# Altium schematic sheet Regulator.SchDoc: Regulation
size A; SheetNumber: 1; SheetTotal: 2
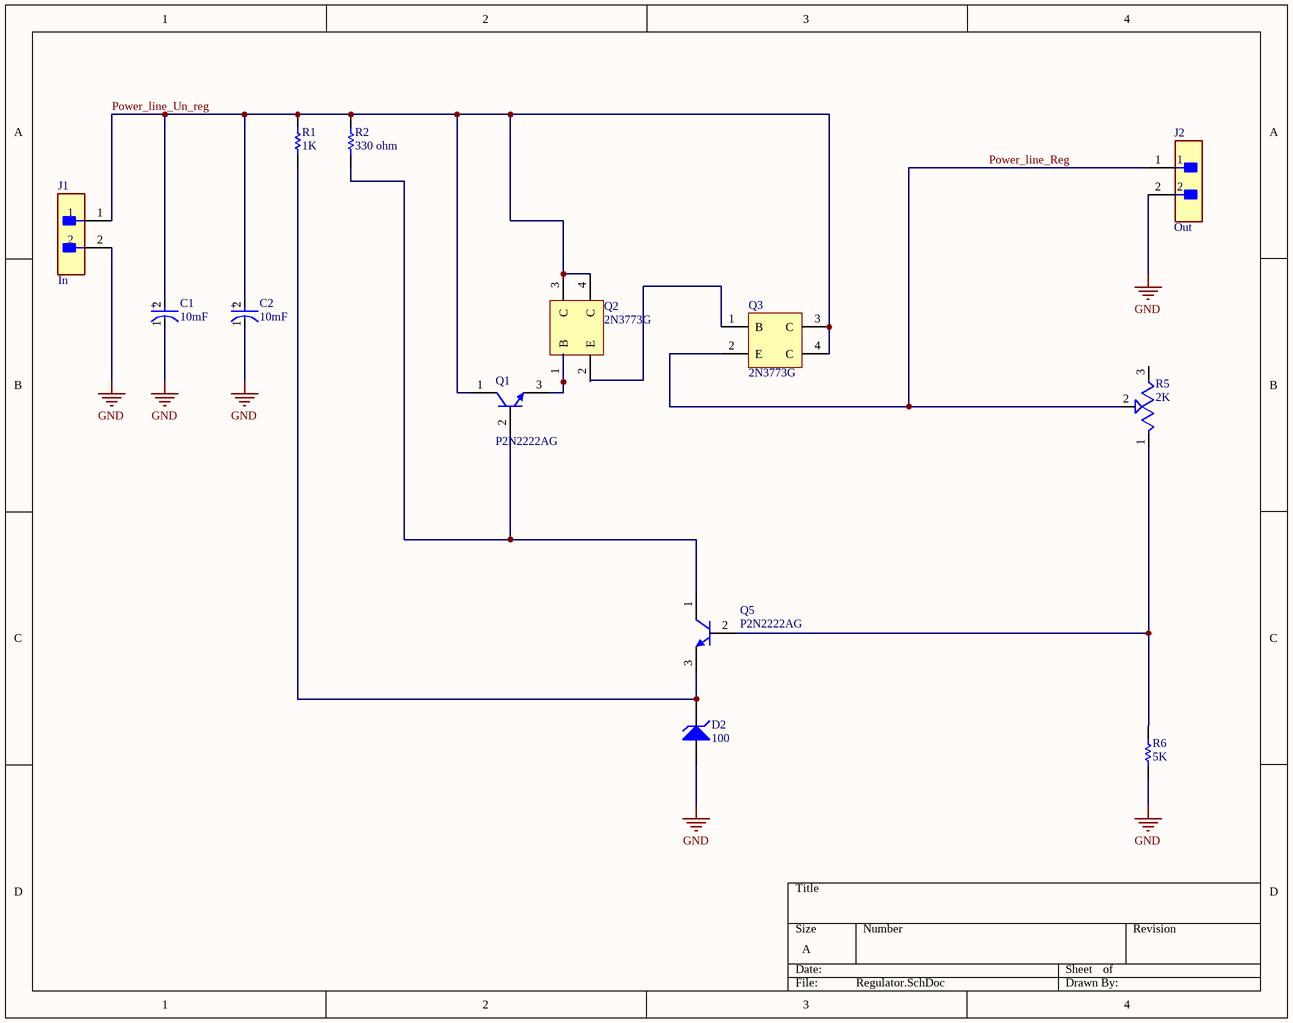
[diagram p0: Regulator.SchDoc]

## Parts
C1  10mF  [FP-RAD-TH-D_16_0_5-L_25_2-MFG]
C2  10mF  [FP-RAD-TH-D_16_0_5-L_25_2-MFG]
D2  BV: 100  (hidden comment: Zener Diode)
J1  In  [FP-B2B-XH-A_LF_SN-MFG]
J2  Out  [FP-B2B-XH-A_LF_SN-MFG]
Q1  P2N2222AG  [ONSC-TO-92-3-29-11]
Q2  2N3773G  [ONSC-TO-204-3-1-07]
Q3  2N3773G  [ONSC-TO-204-3-1-07]
Q5  P2N2222AG  [ONSC-TO-92-3-29-11]
R1  1K  [OMTE-WLA-2_V2]
R2  330 ohm  [OMTE-WLA-2_V2]
R5  2K  [TRIM_3306F-1-104]
R6  5K  [OMTE-WLA-2_V2]

## Nets
GND: C1.1(C) C2.1(C) D2.1(A) J1.2 J2.2 R6.1
Power_line_Reg: J2.1 Q3.2(E) R5.2(W)
Power_line_Un_reg: C1.2(A) C2.2(A) J1.1 Q1.1(C) Q2.3(C) Q2.4(C) Q3.3(C) Q3.4(C) R1.2 R2.2
NetD2_2: D2.2(K) Q5.3(E) R1.1
NetQ1_2: Q1.2(B) Q5.1(C) R2.1
NetQ1_3: Q1.3(E) Q2.1(B)
NetQ2_2: Q2.2(E) Q3.1(B)
NetQ5_2: Q5.2(B) R5.1(CCW) R6.2

Not connected (* = marked no-connect by the designer): R5 3(CW)

## Notes on the sheet
- (in symbol CMP-05427-001523-1) +

## Library data of the parts
C1 C2 = CMP-05427-001523-1: Aluminum Electrolytic Capacitors (Radial Lead Type) AEC-Q200 Qualified 10000uF ±20% 10V; Lead Diameter: 0.8mm; Life (Hours): 2000Hour; Lead/Base Style: Straight; Ripple Current: 1.89A; Voltage Rating: 10V; Series: HD; Case/Package: Radial; Max Operating Temperature: 105°C; Tolerance: 20%; Construction: RADIAL; REACH SVHC: No SVHC; Lead Pitch: 7.5mm; Voltage Rating (DC): 10V; RoHS Compliant: Yes; Packaging: Bulk; Voltage: 10V; Height: 25mm; Termination: Radial; Ripple Current (AC): 1.89A; Min Operating Temperature: -55°C; Diameter: 16mm; Height - Seated (Max): 1.063inch; Capacitance: 10mF; Length: 25mm; Package Quantity: 100; Mount: Through Hole
D2 = Zener Diode: AF: 1; BV_MAX: 1e99; CJO: 0; EG: 1.11; FC: 0.5; IBV: 0.001; IS: 1e-14; MJSW: 0.33; NTUN: 30; TNOM: 27; XTI: 3; SimulationGenericComponent: True; CJP: 0; CTA: 0; CTP: 0; FCS: 0.5; FV_MAX: 1e99; IKF: 0; IKR: 0; ISR: 1e-14; JSW: 0; JTUN: 0; JTUNSW: 0; KEG: 1; KF: 0; LEVEL: 1; N: 1; NBV: 1; NR: 1; NS: 1; PHP: 1; RS: 0; TCV: 0; TLEV: 0; TLEVC: 0; TM1: 0; TM2: 0; TPB: 0; TPHP: 0; TRS: 0; TRS2: 0; TT: 0; TTT1: 0; TTT2: 0; VJ: 1; XTITUN: 3
J1 J2 = CMP-2000-05888-3: CONN HEADER VERT 2POS 2.5MM; Current Rating: 3A; Voltage Rating: 250V; Number of Contacts: 2; Contact Resistance: 20mR; Wire/Cable Gauge: 22AWG; Insulation Resistance: 1GR; Connector Type: Male Pin; Packaging: Bulk; Contact Material: Brass; Lead Free: Lead Free; Orientation: Straight; Contact Plating: Tin; Max Current Rating: 3A; Termination: Solder; Fastening Type: Detent; Depth: 5.75mm; Housing Material: Polyamide; REACH SVHC: No SVHC; Series: XH; Voltage Rating (AC): 250V; Number of Positions: 2; Color: Natural; Contact Type: Male Pin; Max Voltage Rating (DC): 250V; Pitch: 2.5mm; Lead Pitch: 2.5mm; Mount: Through Hole; Max Operating Temperature: 85°C; Length: 7.4mm; Max Voltage Rating (AC): 250V; Min Operating Temperature: -25°C; Number of Rows: 1; Housing Color: White
Q1 Q5 = CMP-1048-01402-1: Amplifier Transistor, NPN Silicon, 3-Pin TO-92, Pb-Free, Bulk Box; Manufacturer: On Semiconductor; IC Continuous (A): 0.6; fT Min (MHz): 300; ComponentLink2Description: Datasheet; ComponentLink1Description: Manufacturer URL; ComponentLink2URL: http://www.onsemi.com/pub_link/Collateral/P2N2222A-D.PDF; ComponentLink3Description: Package Specification; RoHS: TRUE; ComponentLink1URL: http://www.onsemi.com/; PartNumber: P2N2222AG; Mounting Technology: Through Hole; PackageReference: TO-92-3-29-11_AM_SL; Polarity: NPN; Packing: Bulk Box; DatasheetVersion: Rev. 7; PackageDescription: 3-Pin Transistor Outline, Body 4.825 x 3.685 mm, Pitch 1.27 mm; PackageVersion: Rev. AM; ComponentLink3URL: http://www.onsemi.cn/pub_link/Collateral/2N6426-D.PDF
Q2 Q3 = CMP-1048-01054-1: NPN Power Transistor, 3-Pin TO-204, Pb-Free, Tray; Manufacturer: On Semiconductor; IC Continuous (A): 16; Mounting Technology: Through Hole; PartNumber: 2N3773G; ComponentLink1Description: Manufacturer URL; ComponentLink2URL: http://www.onsemi.com/pub_link/Collateral/2N3773-D.PDF; Packing: Tray; ComponentLink3URL: http://www.onsemi.com/pub_link/Collateral/1-07.PDF; PackageReference: TO-204-3-1-07; PackageDescription: 2-Pin Transistor Outline, Body 39.37 x 26.67 mm, Pitch 10.92 mm; DatasheetVersion: Rev. 11; ComponentLink1URL: http://www.onsemi.com/; ComponentLink3Description: Package Specification; RoHS: TRUE; PackageVersion: Rev. Z, 05/1988; ComponentLink2Description: Datasheet; Polarity: NPN
R1 R2 R6 = CMP-1237-00001-1: Miniature Wirewound Current Sense, 0.02 Ohm +/-1%, 0.5 W, 2-Pin THD, RoHS, 25pc Pack; PartNumber: WLAR020FE; Manufacturer: Ohmite; Power Rating: 0.5 W; ComponentLink1URL: http://www.ohmite.com/; ComponentLink3URL: http://www.ohmite.com/cat/res_wl.pdf; DatasheetVersion: May-14; Rated Resistance: 0.02 Ohm; Resistance Tolerance: +/-1%; PackageDescription: 2-Pin Axial Lead, Body 5.08 x 2.54 mm, Lead Spread 25 mm; ComponentLink3Description: Package Specification; RoHS: TRUE; ComponentLink2URL: http://www.ohmite.com/cat/res_wl.pdf; Mounting Technology: Through Hole; Packing: 25pc Pack; ComponentLink2Description: Datasheet; ComponentLink1Description: Manufacturer URL
R5 = 3306F-1-104: 100 kOhms 0.2W, 1/5W PC Pins Through Hole Trimmer Potentiometer Cermet 1 Turn Top Adjustment; MF: Bourns; MP: 3306F-1-104; SnapEDA_Link: https://www.snapeda.com/parts/3306F-1-104/Bourns/view-part/372285/?ref=snap; Price: None; Package: 6432 Bourns; Availability: Unavailable; Value: *; Check_prices: https://www.snapeda.com/parts/3306F-1-104/Bourns/view-part/372285/?ref=eda